# Altium schematic sheet RJ45 Connector and ESD Diodes.SchDoc
size A4; SheetNumber: 18; SheetTotal: 26
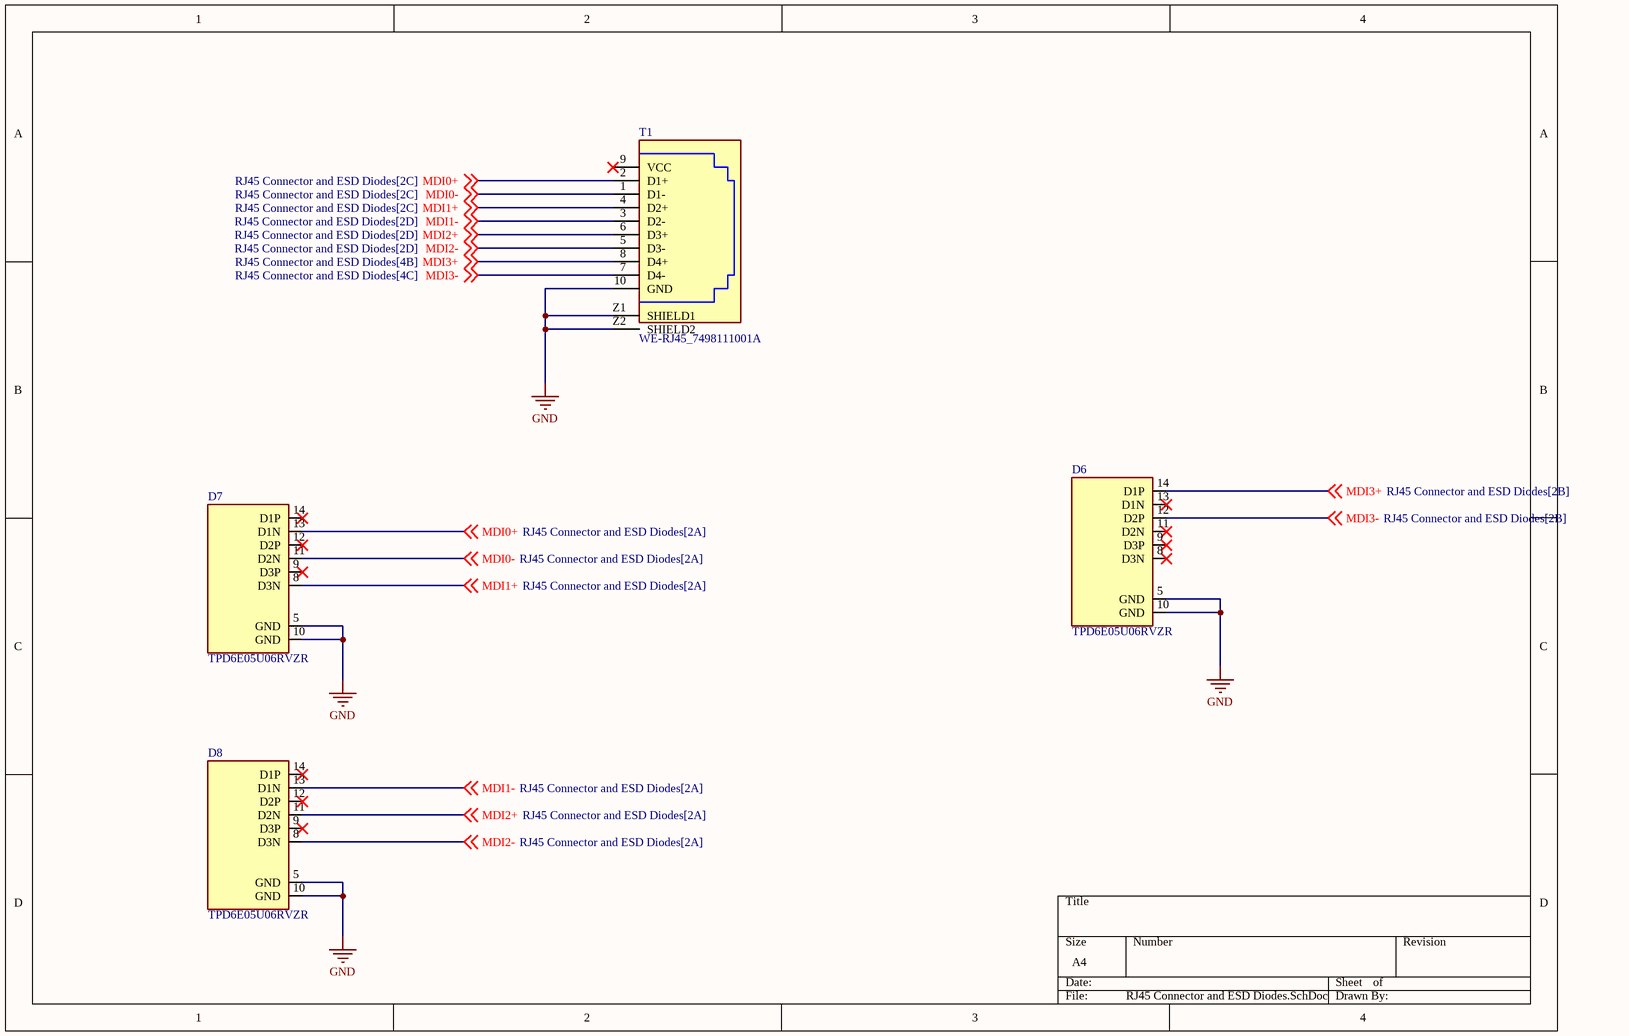
[diagram p0: RJ45 Connector and ESD Diodes.SchDoc]

## Parts
D6  TPD6E05U06RVZR  [SON50P135X350X55-14N]
D7  TPD6E05U06RVZR  [SON50P135X350X55-14N]
D8  TPD6E05U06RVZR  [SON50P135X350X55-14N]
T1  WE-RJ45_7498111001A  [7498111001A]

## Nets
GND: D6.5(GND) D6.10(GND) D7.5(GND) D7.10(GND) D8.5(GND) D8.10(GND) T1.10(GND) T1.Z1(SHIELD1) T1.Z2(SHIELD2)
MDI0+: D7.13(D1N) T1.2(D1+) ; off-sheet MDI0+
MDI0-: D7.11(D2N) T1.1(D1-) ; off-sheet MDI0-
MDI1+: D7.8(D3N) T1.4(D2+) ; off-sheet MDI1+
MDI1-: D8.13(D1N) T1.3(D2-) ; off-sheet MDI1-
MDI2+: D8.11(D2N) T1.6(D3+) ; off-sheet MDI2+
MDI2-: D8.8(D3N) T1.5(D3-) ; off-sheet MDI2-
MDI3+: D6.14(D1P) T1.8(D4+) ; off-sheet MDI3+
MDI3-: D6.12(D2P) T1.7(D4-) ; off-sheet MDI3-

Not connected (* = marked no-connect by the designer): D6 8(D3N)* 9(D3P)* 11(D2N)* 13(D1N)*; D7 9(D3P)* 12(D2P)* 14(D1P)*; D8 9(D3P)* 12(D2P)* 14(D1P)*; T1 9(VCC)*

## Library data of the parts
D6-D8 = TPD6E05U06RVZR: 6-Channel Ultra low capacitance IEC ESD protection diodes 14-USON -40 to 125; MP: TPD6E05U06RVZR; Price: None; Package: None; Value: *; Availability: Unavailable
T1 = WE-RJ45_7498111001A: EMI Gaskets, Sheets, Absorbers & Shielding Integrated RJ45 Transformer WE-RJ45LAN; MF: WÃ¼rth Elektronik; SnapEDA_Link: https://www.snapeda.com/parts/7498111001A/W%25C3%25BCrth+Elektronik+Midcom/view-part/?ref=snap; Package: None; Value: *; MP: 7498111001A; Check_prices: https://www.snapeda.com/parts/7498111001A/W%25C3%25BCrth+Elektronik+Midcom/view-part/?ref=eda